# EAGLE design Dash Switches r2 (EAGLE 7.5.0)
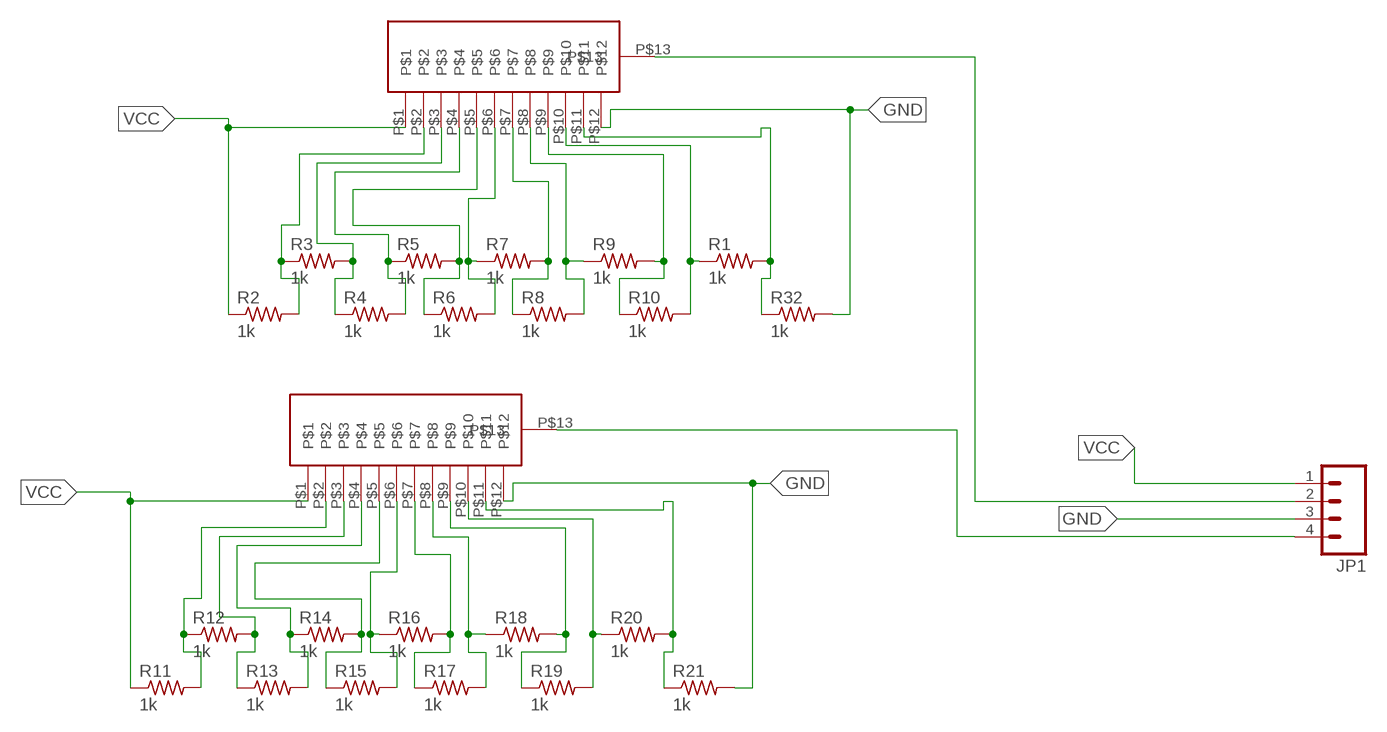
[diagram p0: schematic, sheet 1]

## Parts
JP1  M04LOCK  [1X04_LOCK]
R1  1k  R-US_R0603  [R0603]
R2  1k  R-US_R0603  [R0603]
R3  1k  R-US_R0603  [R0603]
R4  1k  R-US_R0603  [R0603]
R5  1k  R-US_R0603  [R0603]
R6  1k  R-US_R0603  [R0603]
R7  1k  R-US_R0603  [R0603]
R8  1k  R-US_R0603  [R0603]
R9  1k  R-US_R0603  [R0603]
R10  1k  R-US_R0603  [R0603]
R11  1k  R-US_R0603  [R0603]
R12  1k  R-US_R0603  [R0603]
R13  1k  R-US_R0603  [R0603]
R14  1k  R-US_R0603  [R0603]
R15  1k  R-US_R0603  [R0603]
R16  1k  R-US_R0603  [R0603]
R17  1k  R-US_R0603  [R0603]
R18  1k  R-US_R0603  [R0603]
R19  1k  R-US_R0603  [R0603]
R20  1k  R-US_R0603  [R0603]
R21  1k  R-US_R0603  [R0603]
R32  1k  R-US_R0603  [R0603]
U$1  ROTSWITCH  [ROTSWITCH]
U$2  ROTSWITCH  [ROTSWITCH]

## Nets
GND: JP1.3 R21.2 R32.2 U$1.P$12 U$2.P$12
N$1: R1.1 R10.2 U$1.P$10
N$2: R2.2 R3.1 U$1.P$2
N$3: R3.2 R4.1 U$1.P$3
N$4: R4.2 R5.1 U$1.P$4
N$5: R5.2 R6.1 U$1.P$5
N$6: R11.2 R12.1 U$2.P$2
N$7: R12.2 R13.1 U$2.P$3
N$8: R8.2 R9.1 U$1.P$8
N$9: R9.2 R10.1 U$1.P$9
N$10: R13.2 R14.1 U$2.P$4
N$11: R6.2 R7.1 U$1.P$6
N$12: R7.2 R8.1 U$1.P$7
N$13: R14.2 R15.1 U$2.P$5
N$14: R17.2 R18.1 U$2.P$8
N$15: R18.2 R19.1 U$2.P$9
N$16: R15.2 R16.1 U$2.P$6
N$17: R16.2 R17.1 U$2.P$7
N$18: R19.2 R20.1 U$2.P$10
N$19: JP1.4 U$2.P$13
N$20: R20.2 R21.1 U$2.P$11
N$37: JP1.2 U$1.P$13
N$1000: R1.2 R32.1 U$1.P$11
VCC: JP1.1 R2.1 R11.1 U$1.P$1 U$2.P$1

## Library data of the parts
JP1 = SparkFun-Connectors:M04: Header 4 Standard 4-pin 0.1" header. Use with straight break away headers (SKU : PRT-00116), right angle break away headers (PRT-00553), swiss pins (PRT-00743), machine pins (PRT-00117), and female headers (PRT-00115). Molex polarized connector foot print use with SKU : PRT-08231 with associated crimp pins and housings. 1MM SMD Version SKU: PRT-10208
R1-R21 R32 = rcl:R-US_: RESISTOR, American symbol
U$1 U$2 = DashAndCAN library:ROTSWITCH

## Board
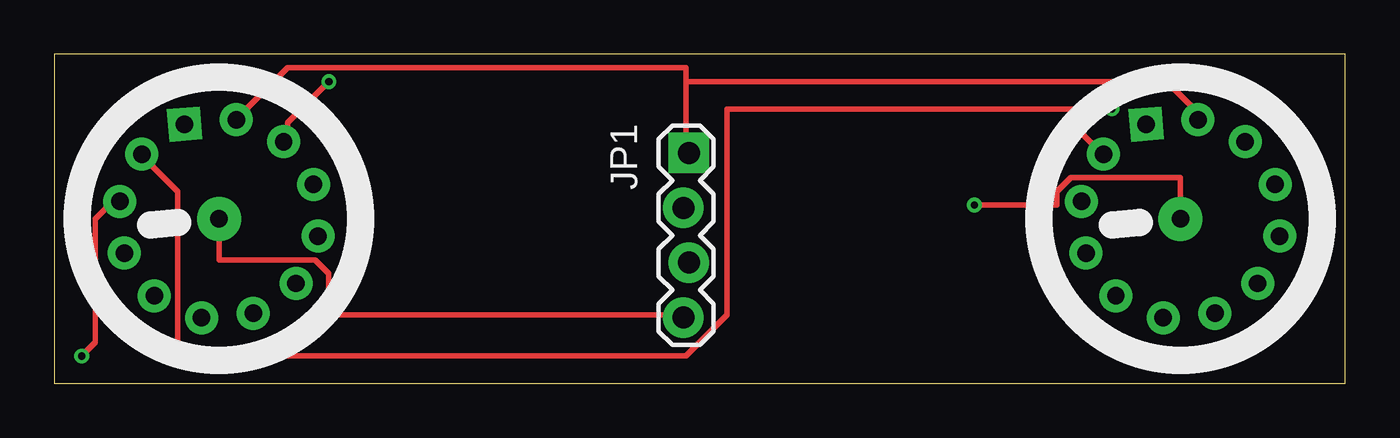
[diagram p1: board, top side]
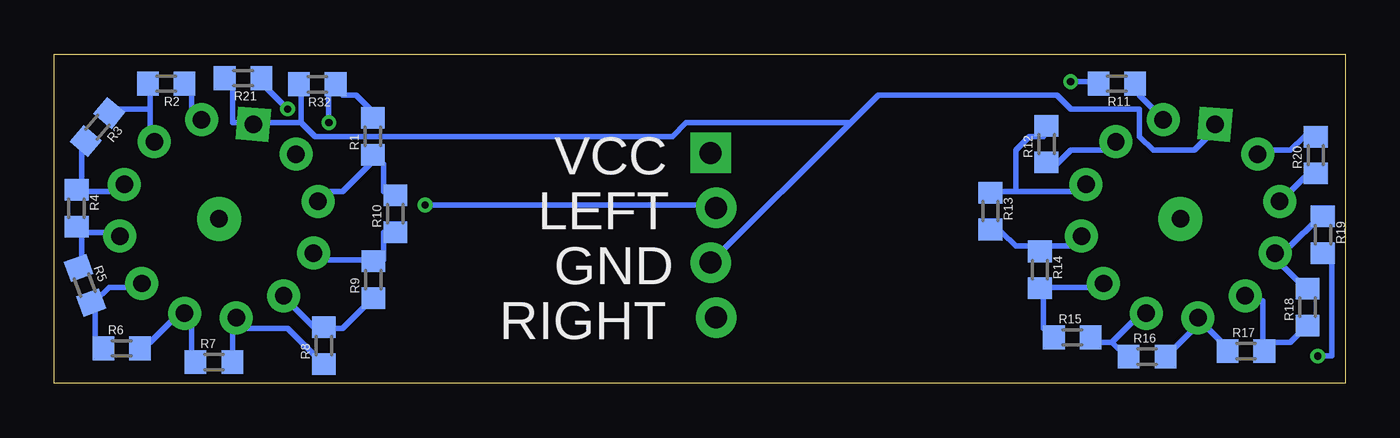
[diagram p2: board, bottom side, seen from below]

Size 59.69 x 15.24 mm. Coordinates in mm from the lower left corner, seen from the top.
Outline: 0,0 59.69,0 59.69,15.24 0,15.24 0,0
Copper layers (1*16): Top 0.0356mm / dielectric 1.5011mm / Bottom 0.0356mm
Design rules "OshPark DRC *": minimum track width 10mil, minimum drill 13mil, track to track 6mil, track to pad 6mil, pad to pad 6mil, via to via 6mil, smd to smd 6mil, copper to edge 15mil, drill to drill 6mil, minimum pad ring 7mil, minimum via ring 7mil, stop-mask expansion 3mil, vias tented up to drill 0mil, thermal gap 10mil

### Footprints (pad centres in the part's own frame; a part is rotated, then mirrored left to right if it is on the bottom)
1X04_LOCK = drill 1.016 pad 1.88 square: 1 0,0.127 | drill 1.016 pad 1.88: 2 2.54,-0.127; 3 5.08,0.127; 4 7.62,-0.127
R0603 = smd 1 x 1.1: 1 -0.85,0; 2 0.85,0
ROTSWITCH = drill 0.8 pad 1.524: P$1 4.49,-1.203; P$2 3.287,-3.287; P$3 1.203,-4.491; P$4 -1.203,-4.491; P$5 -3.287,-3.287; P$6 -4.491,-1.203; P$7 -4.49,1.203; P$8 -3.287,3.287; P$9 -1.203,4.49; P$10 1.203,4.49; P$11 3.287,3.287 | drill 0.8 pad 1.524 square: P$12 4.49,1.203 | drill 0.8 pad 2.032: P$13 0,0

### Placement (x,y rotation side)
JP1  29.21,10.67 270 top
R1  44.96,11.43 90 bottom
R2  54.51,13.87 180 bottom
R3  57.68,11.86 230 bottom
R4  58.65,8.1 270 bottom
R5  58.27,4.55 290 bottom
R6  56.57,1.63 0 bottom
R7  52.3,0.99 0 bottom
R8  47.22,1.75 90 bottom
R9  44.93,4.8 90 bottom
R10  43.92,7.85 90 bottom
R11  10.57,13.87 180 bottom
R12  13.82,11.07 90 bottom
R13  16.41,7.98 270 bottom
R14  14.12,5.26 270 bottom
R15  12.62,2.13 0 bottom
R16  9.17,1.24 0 bottom
R17  4.6,1.5 0 bottom
R18  1.75,3.53 90 bottom
R19  1.04,6.88 270 bottom
R20  1.37,10.57 90 bottom
R21  50.95,14.12 180 bottom
R32  47.52,13.84 180 bottom
U$1  52.07,7.62 95 top
U$2  7.62,7.62 95 top

### Tracks (layer width: path | path; a pad name or v marks a point on that pad's centre or on a via)
GND
  Bottom 0.254: 48.26,12.06 48.26,13.34 R32.2 | 48.26,12.06 50.16,12.06 U$1.P$12 50.8,12.06 51.44,12.06 51.44,13.97 R21.2 | JP1.3 22.86,12.06 | 22.86,12.06 21.59,13.34 13.34,13.34 12.7,12.7 9.53,12.7 9.53,11.43 8.89,10.79 6.99,10.79 6.35,11.43 U$2.P$12 | 48.26,12.06 47.62,11.43 31.11,11.43 30.48,12.06 22.86,12.06
N$1
  Bottom 0.254: R10.2 44.45,8.89 44.45,10.16 R1.1 45.09,10.16 46.35,8.89 46.99,8.89 U$1.P$10
N$2
  Bottom 0.254: 55.24,12.7 55.24,11.43 U$1.P$2 | 55.24,12.7 55.24,13.34 R2.2 | 55.24,12.7 57.15,12.7 R3.1
N$3
  Bottom 0.254: 58.42,8.89 56.52,8.89 U$1.P$3 | 58.42,8.89 58.42,10.79 R3.2 | 58.42,8.89 R4.1
N$4
  Bottom 0.254: 58.42,6.99 58.42,5.71 R5.1 | 58.42,6.99 57.15,6.99 U$1.P$4 | 58.42,6.99 R4.2
N$5
  Bottom 0.254: 57.78,3.81 57.78,1.91 R6.1 | 57.78,3.81 57.15,4.45 55.88,4.45 U$1.P$5 | 57.78,3.81 R5.2
N$6  (via drill 0.33)
  Top 0.254: v12.7,13.97 10.79,12.06 10.79,11.43 U$2.P$2
  Bottom 0.254: R12.1 13.34,10.16 12.7,10.79 10.79,10.79 U$2.P$2 | v12.7,13.97 11.43,13.97 R11.2
N$7
  Bottom 0.254: 15.24,8.89 12.06,8.89 U$2.P$3 | 15.24,8.89 15.88,8.89 R13.1 | 15.24,8.89 15.24,10.79 14.61,11.43 13.97,11.43 R12.2
N$8
  Bottom 0.254: U$1.P$8 48.9,3.81 47.62,2.54 R8.2 46.99,2.54 46.35,2.54 45.09,3.81 R9.1
N$9
  Bottom 0.254: R10.1 44.45,6.99 44.45,5.71 R9.2 45.09,5.71 47.62,5.71 U$1.P$9
N$10
  Bottom 0.254: U$2.P$4 12.7,6.35 13.97,6.35 R14.1 14.61,6.35 15.24,6.35 15.88,6.99 R13.2
N$11
  Bottom 0.254: R7.1 53.34,1.27 53.34,3.17 U$1.P$6 53.98,3.17 55.24,1.91 R6.2
N$12
  Bottom 0.254: R8.1 47.62,1.27 48.9,2.54 50.8,2.54 U$1.P$7 51.44,2.54 51.44,1.27 R7.2
N$13
  Bottom 0.254: 13.97,4.45 13.97,2.54 R15.1 | 13.97,4.45 11.43,4.45 U$2.P$5 | 13.97,4.45 R14.2
N$14
  Bottom 0.254: 3.81,1.91 2.54,1.91 1.91,2.54 R18.1 | 3.81,1.91 3.81,3.81 4.45,3.81 U$2.P$8 | 3.81,1.91 R17.2
N$15
  Bottom 0.254: R18.2 1.91,4.45 3.17,5.71 U$2.P$9 3.17,6.35 2.54,6.35 1.27,7.62 R19.1
N$16
  Bottom 0.254: 10.79,1.91 10.16,1.27 R16.1 | 10.79,1.91 11.43,1.91 R15.2 | 10.79,1.91 9.53,3.17 U$2.P$6
N$17
  Bottom 0.254: R17.1 5.71,1.91 6.35,2.54 U$2.P$7 6.99,2.54 8.26,1.27 R16.2
N$18  (via drill 0.33)
  Top 0.254: v1.27,1.27 1.91,1.91 1.91,7.62 2.54,8.26 U$2.P$10
  Bottom 0.254: v1.27,1.27 0.64,1.27 0.64,5.71 R19.2 | R20.1 1.91,9.53 2.54,8.89 U$2.P$10
N$19
  Top 0.254: U$2.P$13 7.62,5.71 12.06,5.71 12.7,5.08 12.7,3.17 28.57,3.17 JP1.4
N$20  (via drill 0.33)
  Top 0.254: v48.9,12.7 31.11,12.7 31.11,3.17 29.21,1.27 5.71,1.27 5.71,8.89 4.45,10.16 U$2.P$11
  Bottom 0.254: R20.2 1.91,11.43 2.54,10.79 3.81,10.79 U$2.P$11 | v48.9,12.7 50.16,13.97 R21.1
N$37  (via drill 0.33)
  Top 0.254: v42.55,8.26 46.35,8.26 46.35,8.89 46.99,9.53 52.07,9.53 U$1.P$13
  Bottom 0.254: v42.55,8.26 29.21,8.26 JP1.2
N$1000  (via drill 0.33)
  Top 0.254: v46.99,12.06 48.26,10.79 U$1.P$11
  Bottom 0.254: R1.2 45.09,12.7 45.72,13.34 46.35,13.34 R32.1 46.99,13.34 v46.99,12.06
VCC
  Top 0.254: 29.21,13.97 29.21,10.79 JP1.1 | 29.21,13.97 29.21,14.61 10.79,14.61 8.89,12.7 U$2.P$1 | 29.21,13.97 51.44,13.97 52.7,12.7 U$1.P$1
  Bottom 0.254: R2.1 53.34,13.34 53.34,12.7 U$1.P$1 | R11.1 9.53,13.34 8.89,12.7 U$2.P$1

### Text on the board
bNames: VCC | LEFT | GND | RIGHT